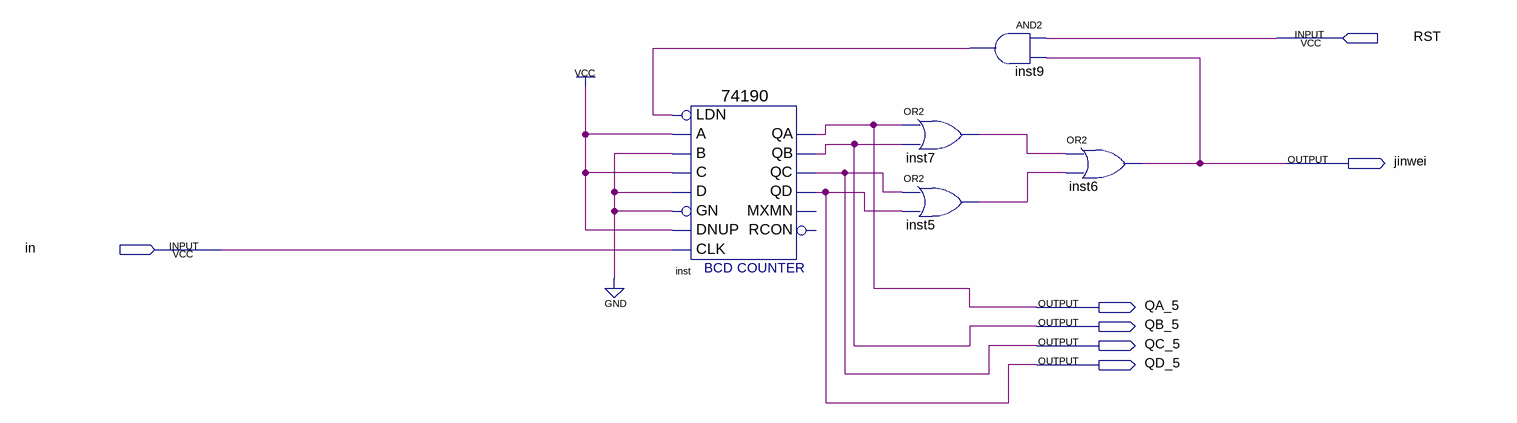
[diagram p0: schematic sheet]
// Quartus schematic jianfa.bdf as structural Verilog: 5 symbols, 7 pins
module jianfa (
  input  RST,
  input  in,
  output jinwei,
  output QA_5,
  output QB_5,
  output QC_5,
  output QD_5
);

  wire inst5_out, inst7_out, inst9_out;

  \74190  inst (
    .LDN(inst9_out), .A(1'b1), .C(1'b1), .B(1'b0), .D(1'b0), .GN(1'b0), .CLK(in), .DNUP(1'b1), .QA(QA_5),
    .QB(QB_5), .QD(QD_5), .QC(QC_5));  // open: MXMN, RCON
  or inst7 (inst7_out, QA_5, QB_5);
  or inst5 (inst5_out, QC_5, QD_5);
  and inst9 (inst9_out, RST, jinwei);
  or inst6 (jinwei, inst7_out, inst5_out);
endmodule
